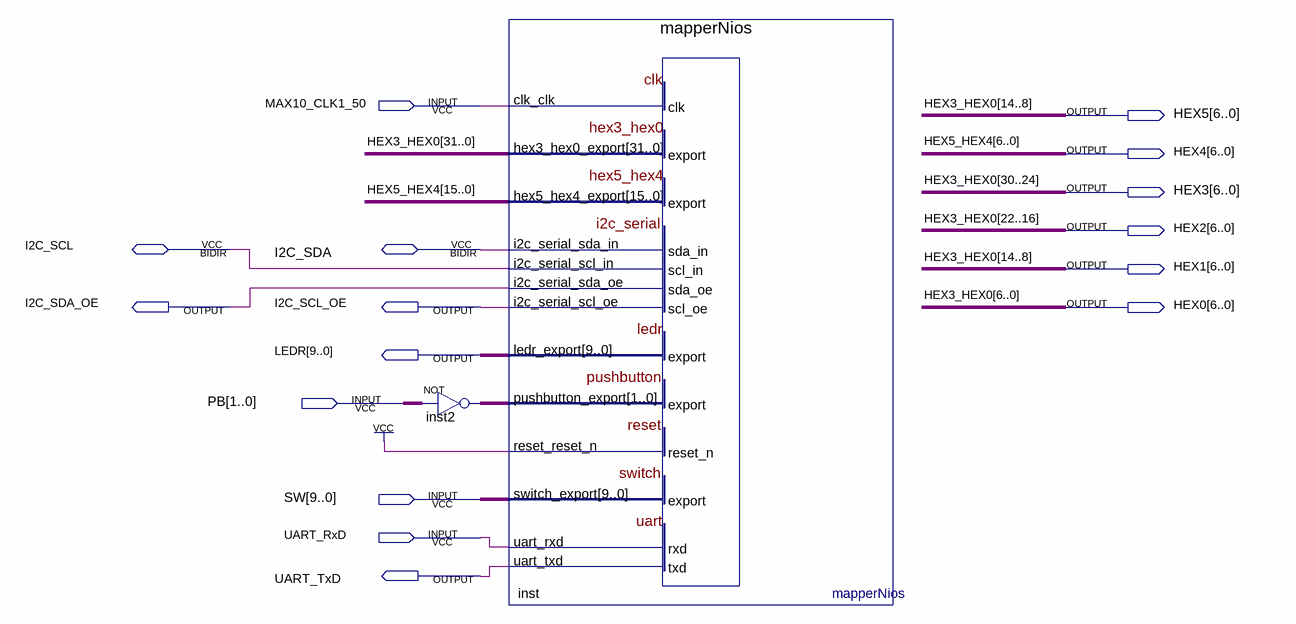
[diagram p0: schematic sheet]
// Quartus schematic Mapper_Controller.bdf as structural Verilog: 2 symbols, 16 pins
module Mapper_Controller (
  input  MAX10_CLK1_50,
  input  [1:0] PB,
  input  [9:0] SW,
  input  UART_RxD,
  inout  I2C_SCL,
  inout  I2C_SDA,
  output [6:0] HEX5,
  output [6:0] HEX4,
  output [6:0] HEX3,
  output [6:0] HEX2,
  output [6:0] HEX1,
  output I2C_SDA_OE,
  output I2C_SCL_OE,
  output [6:0] HEX0,
  output [9:0] LEDR,
  output UART_TxD
);

  wire [1:0] inst2_out;
  wire [15:7] HEX5_HEX4;
  wire [31:7] HEX3_HEX0;

  assign inst2_out = ~PB;  // NOT inst2, 2 bits wide
  mapperNios inst (
    .clk_clk(MAX10_CLK1_50), .i2c_serial_sda_in(I2C_SDA), .i2c_serial_scl_in(I2C_SCL),
    .pushbutton_export(inst2_out), .reset_reset_n(1'b1), .switch_export(SW), .uart_rxd(UART_RxD),
    .hex3_hex0_export({HEX3_HEX0[31], HEX3, HEX3_HEX0[23], HEX2, HEX3_HEX0[15], HEX1, HEX3_HEX0[7], HEX0}),
    .hex5_hex4_export({HEX5_HEX4, HEX4}), .i2c_serial_sda_oe(I2C_SDA_OE), .i2c_serial_scl_oe(I2C_SCL_OE),
    .ledr_export(LEDR), .uart_txd(UART_TxD));

  assign HEX5 = HEX1;

  // Other names for the same wires on the sheet: HEX3_HEX0 (some bits) = {HEX3, HEX2, HEX1, HEX0};
  //   HEX5_HEX4[6:0] = HEX4
endmodule
